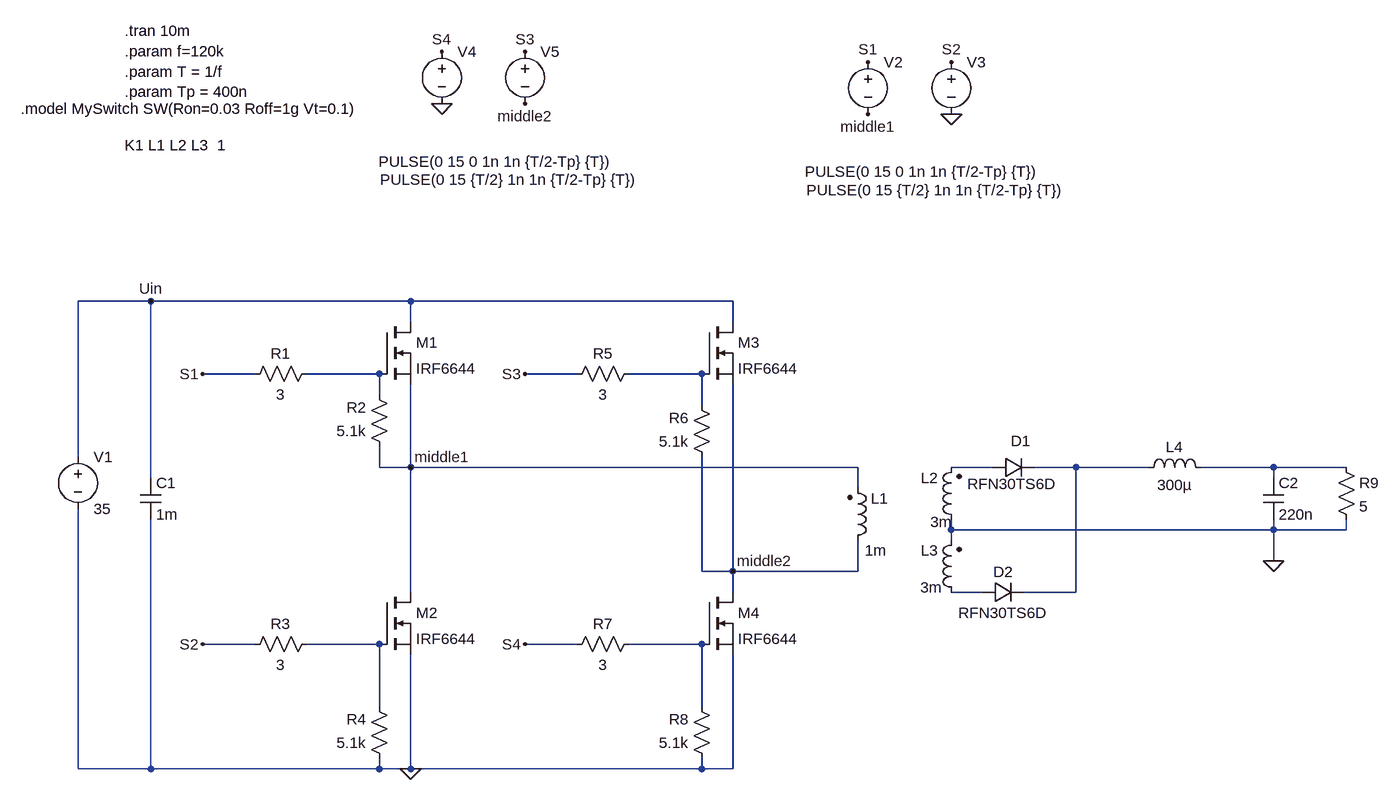
[diagram p0: schematic 1.asc]
1.asc, the LTspice schematic file:
Version 4
SHEET 1 2236 804
WIRE -96 -32 -208 -32
WIRE 304 -32 -96 -32
WIRE 800 -32 304 -32
WIRE 304 0 304 -32
WIRE 800 0 800 -32
WIRE 64 80 -16 80
WIRE 256 80 144 80
WIRE 560 80 480 80
WIRE 752 80 640 80
WIRE 256 112 256 80
WIRE 752 128 752 80
WIRE -208 208 -208 -32
WIRE 256 224 256 192
WIRE 304 224 304 96
WIRE 304 224 256 224
WIRE 992 224 304 224
WIRE 1200 224 1136 224
WIRE 1328 224 1264 224
WIRE 1440 224 1328 224
WIRE 1632 224 1520 224
WIRE 1744 224 1632 224
WIRE -96 240 -96 -32
WIRE 1632 240 1632 224
WIRE 992 256 992 224
WIRE 1136 320 1136 304
WIRE 1632 320 1632 304
WIRE 1632 320 1136 320
WIRE 1744 320 1744 304
WIRE 1744 320 1632 320
WIRE 1136 336 1136 320
WIRE 1632 368 1632 320
WIRE 752 384 752 208
WIRE 800 384 800 96
WIRE 800 384 752 384
WIRE 992 384 992 336
WIRE 992 384 800 384
WIRE 304 416 304 224
WIRE 800 416 800 384
WIRE 1184 416 1136 416
WIRE 1328 416 1328 224
WIRE 1328 416 1248 416
WIRE 64 496 -16 496
WIRE 256 496 144 496
WIRE 560 496 480 496
WIRE 752 496 640 496
WIRE 256 592 256 496
WIRE 752 592 752 496
WIRE -208 688 -208 288
WIRE -96 688 -96 304
WIRE -96 688 -208 688
WIRE 256 688 256 672
WIRE 256 688 -96 688
WIRE 304 688 304 512
WIRE 304 688 256 688
WIRE 752 688 752 672
WIRE 752 688 304 688
WIRE 800 688 800 512
WIRE 800 688 752 688
FLAG 1008 -400 S1
FLAG 1136 -400 S2
FLAG -16 80 S1
FLAG -16 496 S2
FLAG 304 224 middle1
FLAG 1008 -320 middle1
FLAG 1136 -320 0
FLAG 304 688 0
FLAG -96 -32 Uin
FLAG 480 80 S3
FLAG 480 496 S4
FLAG 800 384 middle2
FLAG 352 -416 S4
FLAG 480 -416 S3
FLAG 480 -336 middle2
FLAG 352 -336 0
FLAG 1632 368 0
DATAFLAG 320 208 ""
DATAFLAG 816 384 ""
SYMBOL voltage -208 192 R0
WINDOW 123 0 0 Left 2
WINDOW 39 0 0 Left 2
SYMATTR InstName V1
SYMATTR Value 35
SYMBOL cap -112 240 R0
SYMATTR InstName C1
SYMATTR Value 1m
SYMBOL ind2 976 352 M180
WINDOW 0 36 80 Left 2
WINDOW 3 27 0 Left 2
SYMATTR InstName L1
SYMATTR Value 1m
SYMATTR Type ind
SYMBOL voltage 1008 -416 R0
WINDOW 123 0 0 Left 2
WINDOW 39 0 0 Left 2
WINDOW 3 -97 185 Left 2
SYMATTR Value PULSE(0 15 0 1n 1n {T/2-Tp} {T})
SYMATTR InstName V2
SYMBOL voltage 1136 -416 R0
WINDOW 123 0 0 Left 2
WINDOW 39 0 0 Left 2
WINDOW 3 -223 213 Left 2
SYMATTR Value PULSE(0 15 {T/2} 1n 1n {T/2-Tp} {T})
SYMATTR InstName V3
SYMBOL nmos 256 0 R0
SYMATTR InstName M1
SYMATTR Value IRF6644
SYMBOL res 160 64 R90
WINDOW 0 0 56 VBottom 2
WINDOW 3 32 56 VTop 2
SYMATTR InstName R1
SYMATTR Value 3
SYMBOL res 272 208 R180
WINDOW 0 36 76 Left 2
WINDOW 3 36 40 Left 2
SYMATTR InstName R2
SYMATTR Value 5.1k
SYMBOL res 160 480 R90
WINDOW 0 0 56 VBottom 2
WINDOW 3 32 56 VTop 2
SYMATTR InstName R3
SYMATTR Value 3
SYMBOL res 272 688 R180
WINDOW 0 36 76 Left 2
WINDOW 3 36 40 Left 2
SYMATTR InstName R4
SYMATTR Value 5.1k
SYMBOL res 656 64 R90
WINDOW 0 0 56 VBottom 2
WINDOW 3 32 56 VTop 2
SYMATTR InstName R5
SYMATTR Value 3
SYMBOL res 768 224 R180
WINDOW 0 36 76 Left 2
WINDOW 3 36 40 Left 2
SYMATTR InstName R6
SYMATTR Value 5.1k
SYMBOL res 656 480 R90
WINDOW 0 0 56 VBottom 2
WINDOW 3 32 56 VTop 2
SYMATTR InstName R7
SYMATTR Value 3
SYMBOL res 768 688 R180
WINDOW 0 36 76 Left 2
WINDOW 3 36 40 Left 2
SYMATTR InstName R8
SYMATTR Value 5.1k
SYMBOL voltage 352 -432 R0
WINDOW 123 0 0 Left 2
WINDOW 39 0 0 Left 2
WINDOW 3 -97 185 Left 2
SYMATTR Value PULSE(0 15 0 1n 1n {T/2-Tp} {T})
SYMATTR InstName V4
SYMBOL voltage 480 -432 R0
WINDOW 123 0 0 Left 2
WINDOW 39 0 0 Left 2
WINDOW 3 -223 213 Left 2
SYMATTR Value PULSE(0 15 {T/2} 1n 1n {T/2-Tp} {T})
SYMATTR InstName V5
SYMBOL nmos 256 416 R0
SYMATTR InstName M2
SYMATTR Value IRF6644
SYMBOL nmos 752 0 R0
SYMATTR InstName M3
SYMATTR Value IRF6644
SYMBOL nmos 752 416 R0
SYMATTR InstName M4
SYMATTR Value IRF6644
SYMBOL ind2 1152 320 R180
WINDOW 0 36 80 Left 2
WINDOW 3 14 12 Left 2
SYMATTR InstName L2
SYMATTR Value 3m
SYMATTR Type ind
SYMBOL res 1728 208 R0
SYMATTR InstName R9
SYMATTR Value 5
SYMBOL diode 1200 240 R270
WINDOW 0 41 43 VTop 2
WINDOW 3 6 30 VBottom 2
SYMATTR InstName D1
SYMATTR Value RFN30TS6D
SYMBOL ind2 1152 432 R180
WINDOW 0 36 80 Left 2
WINDOW 3 30 23 Left 2
SYMATTR InstName L3
SYMATTR Value 3m
SYMATTR Type ind
SYMBOL diode 1184 432 R270
WINDOW 0 32 32 VTop 2
WINDOW 3 0 32 VBottom 2
SYMATTR InstName D2
SYMATTR Value RFN30TS6D
SYMBOL cap 1616 240 R0
SYMATTR InstName C2
SYMATTR Value 220n
SYMBOL ind 1424 240 R270
WINDOW 0 32 56 VTop 2
WINDOW 3 5 56 VBottom 2
SYMATTR InstName L4
SYMATTR Value 300µ
TEXT -136 -272 Left 2 !K1 L1 L2 L3  1
TEXT -136 -448 Left 2 !.tran 10m\n.param f=120k\n.param T = 1/f\n.param Tp = 400n
TEXT -296 -328 Left 2 !.model MySwitch SW(Ron=0.03 Roff=1g Vt=0.1)

The netlist it stands for:
* 1.asc
V1 Uin 0 35
C1 Uin 0 1m
L1 middle2 middle1 1m
V2 S1 middle1 PULSE(0 15 0 1n 1n {T/2-Tp} {T})
V3 S2 0 PULSE(0 15 {T/2} 1n 1n {T/2-Tp} {T})
M1 Uin N001 middle1 middle1 IRF6644
R1 N001 S1 3
R2 middle1 N001 5.1k
R3 N007 S2 3
R4 0 N007 5.1k
R5 N002 S3 3
R6 middle2 N002 5.1k
R7 N008 S4 3
R8 0 N008 5.1k
V4 S4 0 PULSE(0 15 0 1n 1n {T/2-Tp} {T})
V5 S3 middle2 PULSE(0 15 {T/2} 1n 1n {T/2-Tp} {T})
M2 middle1 N007 0 0 IRF6644
M3 Uin N002 middle2 middle2 IRF6644
M4 middle2 N008 0 0 IRF6644
L2 0 N003 3m
R9 N005 0 5
D1 N003 N004 RFN30TS6D
L3 N006 0 3m
D2 N006 N004 RFN30TS6D
C2 N005 0 220n
L4 N004 N005 300µ
.model D D
.lib standard.dio
.model NMOS NMOS
.model PMOS PMOS
.lib standard.mos
K1 L1 L2 L3  1
.tran 10m
.param f=120k
.param T = 1/f
.param Tp = 400n
.model MySwitch SW(Ron=0.03 Roff=1g Vt=0.1)
.backanno
.end